# EAGLE schematic Main Board (EAGLE 7.7.0)
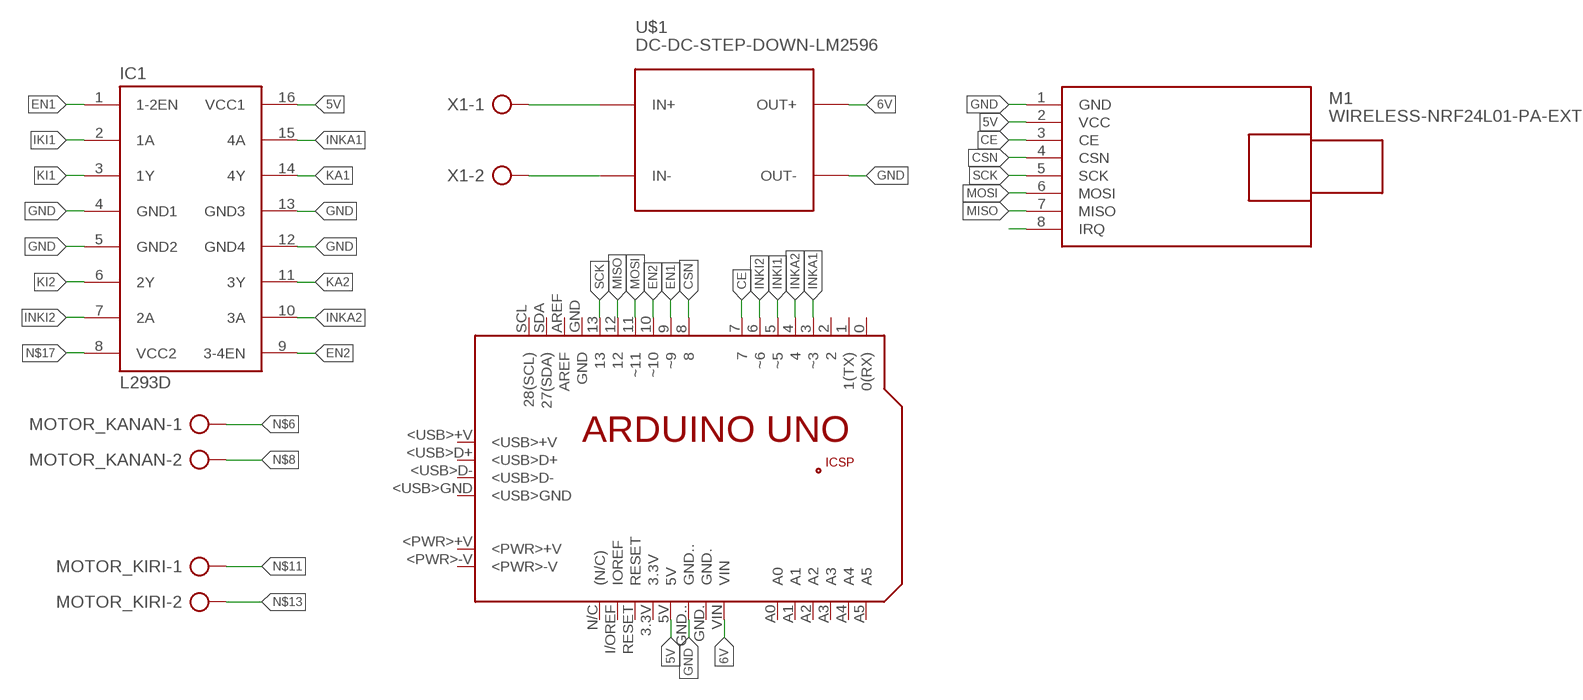
[diagram p0: schematic, sheet 1]

## Parts
IC1  L293D  [DIL16]
M1  WIRELESS-NRF24L01-PA-EXT  [WIRELESS-NRF24L01-PA-EXT]
MOTOR_KANAN  AK500/2-H  [AK500/2-H]
MOTOR_KIRI  AK500/2-H  [AK500/2-H]
PCB1  ARDUINO_UNO  [ARDUINO_UNO]
U$1  DC-DC-STEP-DOWN-LM2596  [DC-DC-STEP-DOWN-LM2596]
X1  AK300/2  [AK300/2]

## Nets
5V: IC1.16(VCC1) M1.2(VCC) PCB1.5V
6V: PCB1.VIN U$1.OUT+
CE: M1.3(CE) PCB1.7
CSN: M1.4(CSN) PCB1.8
EN1: IC1.1(1-2EN) PCB1.9(~9)
EN2: IC1.9(3-4EN) PCB1.10(~10)
GND: IC1.4(GND1) IC1.5(GND2) IC1.12(GND4) IC1.13(GND3) M1.1(GND) PCB1.GND.. U$1.OUT-
IKI1: IC1.2(1A)
INKA1: IC1.15(4A) PCB1.3(~3)
INKA2: IC1.10(3A) PCB1.4
INKI1: PCB1.5(~5)
INKI2: IC1.7(2A) PCB1.6(~6)
KA1: IC1.14(4Y)
KA2: IC1.11(3Y)
KI1: IC1.3(1Y)
KI2: IC1.6(2Y)
MISO: M1.7(MISO) PCB1.12
MOSI: M1.6(MOSI) PCB1.11(~11)
N$1: U$1.IN+ X1.1
N$2: U$1.IN- X1.2
N$6: MOTOR_KANAN.1
N$8: MOTOR_KANAN.2
N$11: MOTOR_KIRI.1
N$12: M1.8(IRQ)
N$13: MOTOR_KIRI.2
N$17: IC1.8(VCC2)
SCK: M1.5(SCK) PCB1.13
Unconnected: PCB1.0(0(RX)) PCB1.1(1(TX)) PCB1.2 PCB1.3.3V PCB1.+5V PCB1.<PWR>+V PCB1.<PWR>-V PCB1.<USB>+V PCB1.<USB>D+ PCB1.<USB>D- PCB1.<USB>GND PCB1.A0 PCB1.A1 PCB1.A2 PCB1.A3 PCB1.A4 PCB1.A5 PCB1.AREF PCB1.GND PCB1.GND. PCB1.GND_ PCB1.I/OREF(IOREF) PCB1.MISO PCB1.MOSI PCB1.N/C((N/C)) PCB1.RESET PCB1.RESET. PCB1.SCK PCB1.SCL(28(SCL)) PCB1.SDA(27(SDA))

## Library data of the parts
IC1 = st-microelectronics:L293D: PUSH-PULL 4 CHANNEL DRIVER; MPN: L293D; OC_FARNELL: 9589619; OC_NEWARK: 56P8249
M1 = diy-modules:WIRELESS-NRF24L01-PA-EXT: 2.4 GHz Wireless Module based on NRF24L01 chip with preamplifier and external antenna Click here to find device on ebay.com <http://www.ebay.com/sch/nrf24l01+pa+lna+sma>
MOTOR_KANAN MOTOR_KIRI = con-ptr500:AK500/2-H: CONNECTOR Aug. 2004 / PTR Meßtechnik: Die Bezeichnung der Serie AK505 wurde geändert. Es handelt sich hierbei um AK500 in horizontaler Ausführung.; OC_FARNELL: unknown; OC_NEWARK: unknown
PCB1 = arduino:ARDUINO_UNO: Device for representing an Arduino Uno board with a footprint in an EAGLE design. Created by Dave Young for Element14. More EAGLE documentation at: http://www.element14.com/community/community/knode/cadsoft_eagle
U$1 = diy-modules:DC-DC-STEP-DOWN-LM2596: DC/DC Step-Down Regulator based on LM2596-ADJ chip LM2596 datasheet available here: http://www.ti.com/lit/ds/symlink/lm2596.pdf Click here to find device on ebay.com <http://www.ebay.com/sch/lm2596+power+regulator>
X1 = con-ptr500:AK300/2: CONNECTOR; OC_FARNELL: unknown; OC_NEWARK: unknown